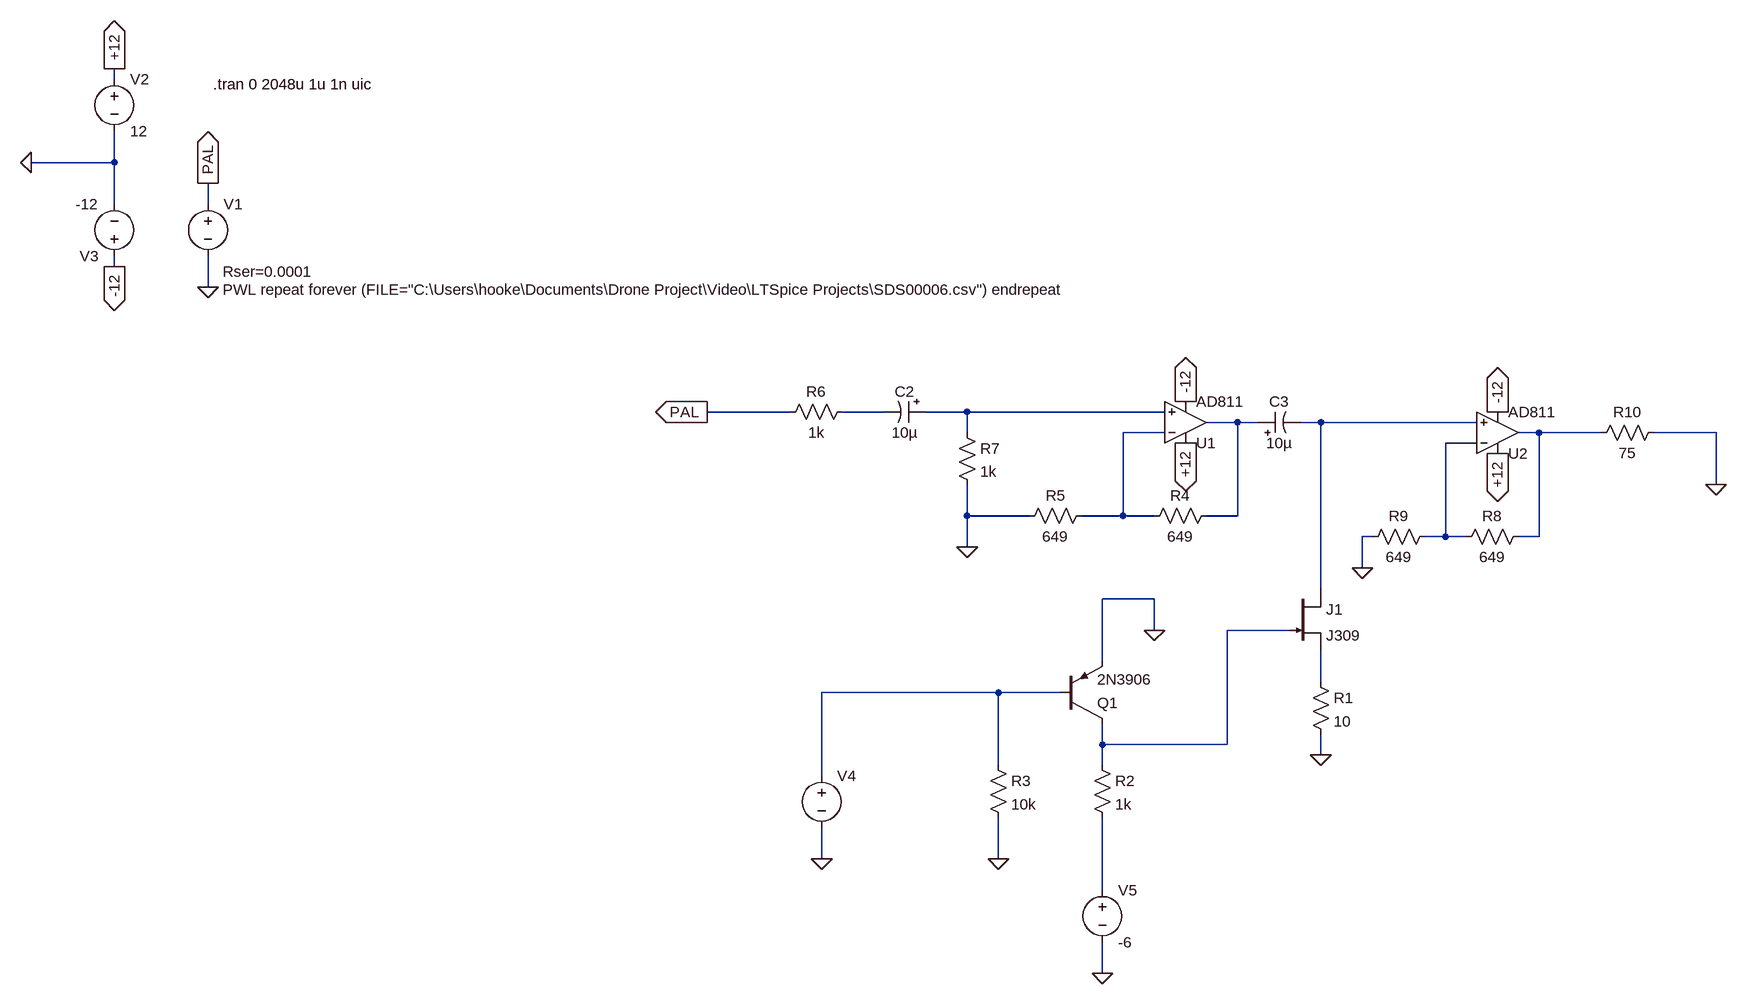
[diagram p0: schematic Keyed_Clamp.asc]
Keyed_Clamp.asc, the LTspice schematic file:
Version 4
SHEET 1 880 788
WIRE -1712 -608 -1712 -624
WIRE -1712 -480 -1712 -528
WIRE -1712 -480 -1840 -480
WIRE -1712 -416 -1712 -480
WIRE -1568 -416 -1568 -448
WIRE -1712 -320 -1712 -336
WIRE -1568 -288 -1568 -336
WIRE -672 -96 -800 -96
WIRE -528 -96 -592 -96
WIRE -400 -96 -464 -96
WIRE -96 -96 -400 -96
WIRE 16 -80 -32 -80
WIRE 48 -80 16 -80
WIRE 144 -80 112 -80
WIRE 384 -80 144 -80
WIRE -400 -64 -400 -96
WIRE -96 -64 -160 -64
WIRE 480 -64 448 -64
WIRE 576 -64 480 -64
WIRE 752 -64 656 -64
WIRE 384 -48 336 -48
WIRE 752 16 752 -64
WIRE -400 64 -400 16
WIRE -304 64 -400 64
WIRE -160 64 -160 -64
WIRE -160 64 -224 64
WIRE -112 64 -160 64
WIRE 16 64 16 -80
WIRE 16 64 -32 64
WIRE 224 96 208 96
WIRE 336 96 336 -48
WIRE 336 96 304 96
WIRE 368 96 336 96
WIRE 480 96 480 -64
WIRE 480 96 448 96
WIRE -400 112 -400 64
WIRE 208 144 208 96
WIRE 144 176 144 -80
WIRE -112 192 -192 192
WIRE -112 240 -112 192
WIRE 96 240 0 240
WIRE -192 288 -192 192
WIRE 144 320 144 272
WIRE -352 336 -624 336
WIRE -256 336 -352 336
WIRE -192 416 -192 384
WIRE 0 416 0 240
WIRE 0 416 -192 416
WIRE 144 432 144 400
WIRE -352 448 -352 336
WIRE -192 448 -192 416
WIRE -624 464 -624 336
WIRE -624 592 -624 544
WIRE -352 592 -352 528
WIRE -192 640 -192 528
WIRE -192 768 -192 720
FLAG 144 432 0
FLAG -112 240 0
FLAG -352 592 0
FLAG -400 112 0
FLAG -800 -96 PAL
IOPIN -800 -96 Out
FLAG 208 144 0
FLAG -1568 -448 PAL
IOPIN -1568 -448 Out
FLAG -1568 -288 0
FLAG -1712 -624 +12
IOPIN -1712 -624 Out
FLAG -1712 -320 -12
IOPIN -1712 -320 Out
FLAG -1840 -480 0
FLAG -624 592 0
FLAG 752 16 0
FLAG -64 -112 -12
IOPIN -64 -112 Out
FLAG 416 -96 -12
IOPIN 416 -96 Out
FLAG -64 -48 +12
IOPIN -64 -48 Out
FLAG 416 -32 +12
IOPIN 416 -32 Out
FLAG -192 768 0
SYMBOL Opamps\\AD811 -64 -16 M180
SYMATTR InstName U1
SYMBOL Opamps\\AD811 416 0 M180
SYMATTR InstName U2
SYMBOL njf 96 176 R0
SYMATTR InstName J1
SYMATTR Value J309
SYMBOL res 128 304 R0
SYMATTR InstName R1
SYMATTR Value 10
SYMBOL pnp -256 384 M180
SYMATTR InstName Q1
SYMATTR Value 2N3906
SYMBOL res -208 432 R0
SYMATTR InstName R2
SYMATTR Value 1k
SYMBOL res -368 432 R0
SYMATTR InstName R3
SYMATTR Value 10k
SYMBOL res -16 48 R90
WINDOW 0 0 56 VBottom 2
WINDOW 3 32 56 VTop 2
SYMATTR InstName R4
SYMATTR Value 649
SYMBOL res -208 48 R90
WINDOW 0 0 56 VBottom 2
WINDOW 3 32 56 VTop 2
SYMATTR InstName R5
SYMATTR Value 649
SYMBOL res 464 80 R90
WINDOW 0 0 56 VBottom 2
WINDOW 3 32 56 VTop 2
SYMATTR InstName R8
SYMATTR Value 649
SYMBOL res 320 80 R90
WINDOW 0 0 56 VBottom 2
WINDOW 3 32 56 VTop 2
SYMATTR InstName R9
SYMATTR Value 649
SYMBOL res 672 -80 R90
WINDOW 0 0 56 VBottom 2
WINDOW 3 32 56 VTop 2
SYMATTR InstName R10
SYMATTR Value 75
SYMBOL voltage -1568 -432 R0
WINDOW 39 23 120 Left 2
WINDOW 3 23 148 Left 2
SYMATTR SpiceLine Rser=0.0001
SYMATTR Value PWL repeat forever (FILE="C:\Users\hooke\Documents\Drone Project\Video\LTSpice Projects\SDS00006.csv") endrepeat
SYMATTR InstName V1
SYMBOL voltage -1712 -624 R0
WINDOW 123 0 0 Left 0
WINDOW 39 0 0 Left 0
SYMATTR InstName V2
SYMATTR Value 12
SYMBOL voltage -1712 -320 R180
WINDOW 123 0 0 Left 0
WINDOW 39 0 0 Left 0
SYMATTR InstName V3
SYMATTR Value -12
SYMBOL voltage -624 448 R0
WINDOW 3 24 96 Invisible 2
WINDOW 123 0 0 Left 0
WINDOW 39 0 0 Left 0
SYMATTR Value PULSE(0 5 0 0.1n 0.1n 4.7u 64u)
SYMATTR InstName V4
SYMBOL polcap -464 -112 R90
WINDOW 0 0 32 VBottom 2
WINDOW 3 32 32 VTop 2
SYMATTR InstName C2
SYMATTR Value 10µ
SYMBOL res -576 -112 R90
WINDOW 0 0 56 VBottom 2
WINDOW 3 32 56 VTop 2
SYMATTR InstName R6
SYMATTR Value 1k
SYMBOL res -416 -80 R0
SYMATTR InstName R7
SYMATTR Value 1k
SYMBOL polcap 48 -64 R270
WINDOW 0 32 32 VTop 2
WINDOW 3 0 32 VBottom 2
SYMATTR InstName C3
SYMATTR Value 10µ
SYMBOL voltage -192 624 R0
WINDOW 123 0 0 Left 0
WINDOW 39 0 0 Left 0
SYMATTR InstName V5
SYMATTR Value -6
TEXT -1560 -600 Left 2 !.tran 0 2048u 1u 1n uic

The netlist it stands for:
* Keyed_Clamp.asc
XU1 N002 N005 +12 -12 N003 AD811  ; pins In+ In- V+ V- OUT
XU2 N004 N007 +12 -12 N006 AD811  ; pins In+ In- V+ V- OUT
J1 N004 N008 N009 J309
R1 N009 0 10
Q1 N008 N010 0 0 2N3906
R2 N008 N011 1k
R3 N010 0 10k
R4 N003 N005 649
R5 N005 0 649
R8 N006 N007 649
R9 N007 0 649
R10 0 N006 75
V1 PAL 0 PWL repeat forever (FILE="C:\Users\hooke\Documents\Drone Project\Video\LTSpice Projects\SDS00006.csv") endrepeat Rser=0.0001
V2 +12 0 12
V3 -12 0 -12
V4 N010 0 PULSE(0 5 0 0.1n 0.1n 4.7u 64u)
C2 N002 N001 10µ
R6 N001 PAL 1k
R7 N002 0 1k
C3 N003 N004 10µ
V5 N011 0 -6
.model NPN NPN
.model PNP PNP
.lib standard.bjt
.model NJF NJF
.model PJF PJF
.lib standard.jft
.tran 0 2048u 1u 1n uic
.backanno
.end